# Altium schematic sheet LM317L_C54442801_LM317L_C5444280.schdoc.schdoc
size 127 x 99 mm
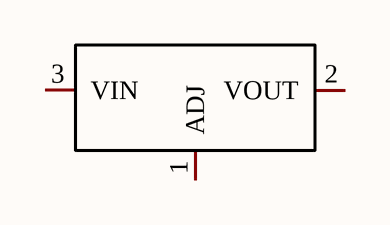
[diagram p0: LM317L_C54442801_LM317L_C5444280.schdoc.schdoc]

## Parts
U?  LM317L_C5444280  [SOT-89-3_L4.5-W2.5-P1.50-LS4.2-BR]  (value not drawn)

## Nets

Not connected (* = marked no-connect by the designer): U? 1(ADJ) 2(VOUT) 3(VIN)

## Library data of the parts
U? = LM317L_C5444280: Manufacturer: Siproin(上海矽朋); Manufacturer Part: LM317L; Add into BOM: yes; Output Type: 可调; Output Polarity: 正; Number of Outputs: 1; Maximum Input Voltage: 40V; Output Voltage: 1.7V~37V; Output Current: 1.5A; Symbol: LM317L_C5444280; Device: LM317L_C5444280; Supplier: LCSC; Supplier Part: C5444280; LCSC Part Name: LM317L; Supplier Footprint: SOT-89; JLCPCB Part Class: Extended Part; Datasheet: https://atta.szlcsc.com/upload/public/pdf/source/20230412/703E44E72FEA4765420A69E1CD3AD9D7.pdf; Convert to PCB: yes